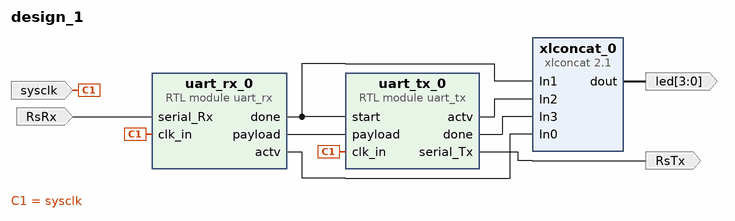
[diagram p0: block diagram of the top level]
# Vivado block design design_1, xc7a35tcpg236-1, Vivado 2024.2
create_bd_design design_1

create_bd_port -dir I RsRx
create_bd_port -dir O -from 3 -to 0 led
create_bd_port -dir O RsTx
create_bd_port -dir I sysclk

create_bd_cell -type ip -vlnv xilinx.com:ip:xlconcat:2.1 xlconcat_0
set_property -dict {CONFIG.NUM_PORTS 4} [get_bd_cells xlconcat_0]
create_bd_cell -type module -reference uart_rx uart_rx_0
create_bd_cell -type module -reference uart_tx uart_tx_0

# ---- connections ----

connect_bd_net [get_bd_ports RsRx] [get_bd_pins uart_rx_0/serial_Rx]
connect_bd_net [get_bd_ports sysclk] [get_bd_pins uart_rx_0/clk_in] [get_bd_pins uart_tx_0/clk_in]
connect_bd_net [get_bd_pins uart_rx_0/actv] [get_bd_pins xlconcat_0/In0]
connect_bd_net [get_bd_pins uart_rx_0/done] [get_bd_pins xlconcat_0/In1] [get_bd_pins uart_tx_0/start]
connect_bd_net [get_bd_pins uart_rx_0/payload] [get_bd_pins uart_tx_0/payload]
connect_bd_net [get_bd_pins uart_tx_0/actv] [get_bd_pins xlconcat_0/In2]
connect_bd_net [get_bd_pins uart_tx_0/done] [get_bd_pins xlconcat_0/In3]
connect_bd_net [get_bd_pins uart_tx_0/serial_Tx] [get_bd_ports RsTx]
connect_bd_net [get_bd_pins xlconcat_0/dout] [get_bd_ports led]

set_property USER_COMMENTS.comment_0 {LED output for debugging active/done
flags in rx and tx} [current_bd_design]

validate_bd_design
save_bd_design
